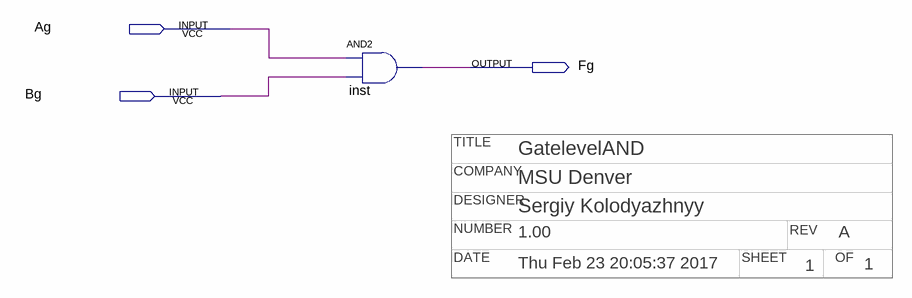
[diagram p0: schematic sheet]
// Quartus schematic GatelevelAND.bdf as structural Verilog: 1 symbols, 3 pins
// Title block: COMPANY: MSU Denver; DATE: Thu Feb 23 20:05:37 2017; DESIGNER: Sergiy Kolodyazhnyy; NUMBER: 1.00; OF: 1; REV: A; SHEET: 1; TITLE: GatelevelAND
module GatelevelAND (
  input  Ag,
  input  Bg,
  output Fg
);

  and inst (Fg, Ag, Bg);
endmodule
